# Altium schematic sheet Roomba.SchDoc
size Legal
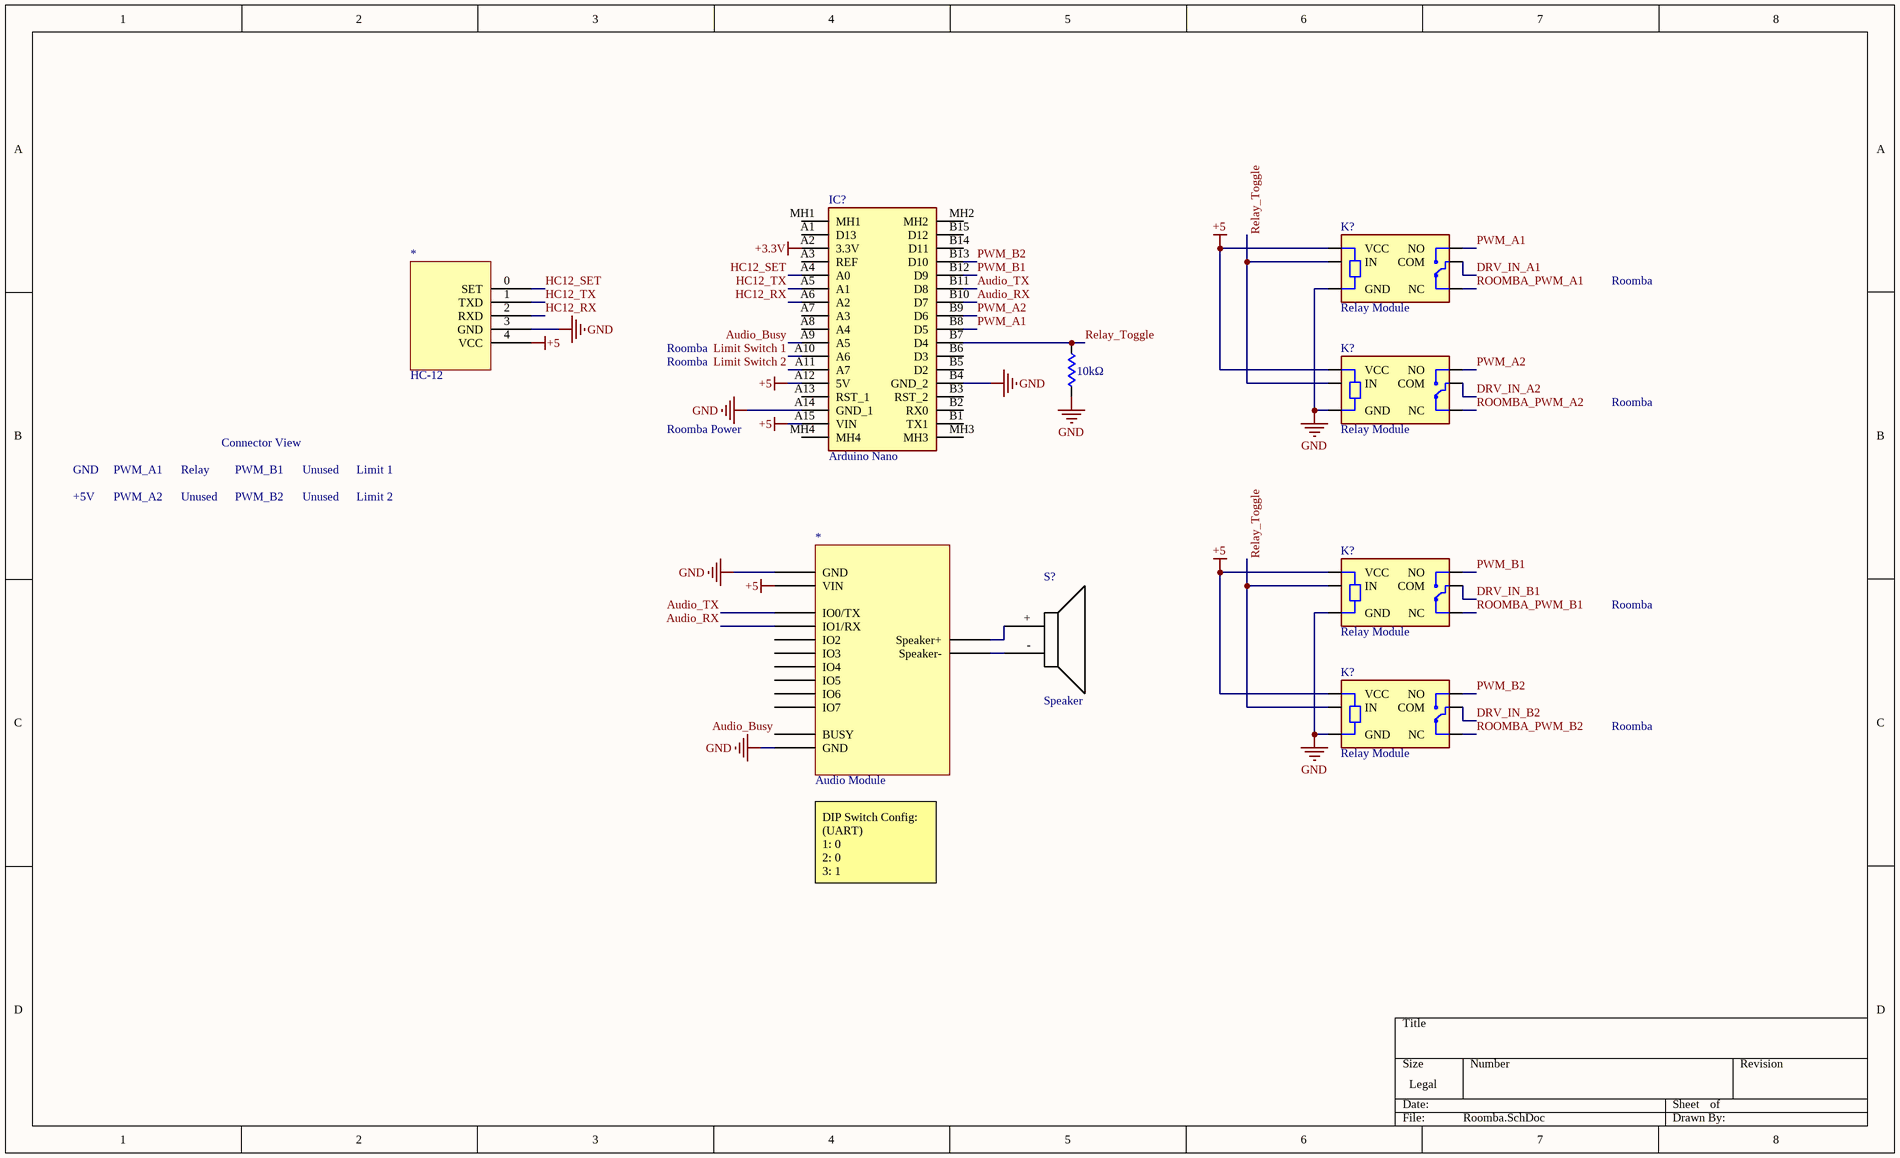
[diagram p0: Roomba.SchDoc]

## Parts
(Parts that share a designator on the sheet are numbered #1, #2 ... from top to bottom, then left to right.)
*#1  HC-12
*#2  Audio Module
?  10kΩ  [0402]
IC?  Arduino Nano  [ABX00028]
K?#1  Relay Module
K?#2  Relay Module
K?#3  Relay Module
K?#4  Relay Module
S?  Speaker

## Nets
+3.3V: IC?.A2(3.3V)
+5: *#1.4(VCC) *#2.?2(VIN) IC?.A12(5V) IC?.A15(VIN) K?#1.?1(VCC) K?#2.?1(VCC) K?#3.?1(VCC) K?#4.?1(VCC)
GND: *#1.3(GND) *#2.?1(GND) *#2.?12(GND) ?.1 IC?.A14(GND_1) IC?.B4(GND_2) K?#1.?3(GND) K?#2.?3(GND) K?#3.?3(GND) K?#4.?3(GND)
Audio_Busy: *#2.?11(BUSY) IC?.A9(A5)
Audio_RX: *#2.?4(IO1/RX) IC?.B10(D7)
Audio_TX: *#2.?3(IO0/TX) IC?.B11(D8)
DRV_IN_A1: K?#1.?5(COM)
DRV_IN_A2: K?#2.?5(COM)
DRV_IN_B1: K?#3.?5(COM)
DRV_IN_B2: K?#4.?5(COM)
HC12_RX: *#1.2(RXD) IC?.A6(A2)
HC12_SET: *#1.0(SET) IC?.A4(A0)
HC12_TX: *#1.1(TXD) IC?.A5(A1)
Limit Switch 1: IC?.A10(A6)
Limit Switch 2: IC?.A11(A7)
PWM_A1: IC?.B8(D5) K?#1.?4(NO)
PWM_A2: IC?.B9(D6) K?#2.?4(NO)
PWM_B1: IC?.B12(D9) K?#3.?4(NO)
PWM_B2: IC?.B13(D10) K?#4.?4(NO)
Relay_Toggle: ?.2 IC?.B7(D4) K?#1.?2(IN) K?#2.?2(IN) K?#3.?2(IN) K?#4.?2(IN)
ROOMBA_PWM_A1: K?#1.?6(NC)
ROOMBA_PWM_A2: K?#2.?6(NC)
ROOMBA_PWM_B1: K?#3.?6(NC)
ROOMBA_PWM_B2: K?#4.?6(NC)
Net*#2_?13: *#2.?13(Speaker+) S?.+
Net*#2_?14: *#2.?14(Speaker-) S?.-

Not connected (* = marked no-connect by the designer): *#2 ?5(IO2) ?6(IO3) ?7(IO4) ?8(IO5) ?9(IO6) ?10(IO7); IC? A1(D13) A3(REF) A7(A3) A8(A4) A13(RST_1) B1(TX1) B2(RX0) B3(RST_2) B5(D2) B6(D3) B14(D11) B15(D12) MH1 MH2 MH3 MH4

## Notes on the sheet
- Roomba
- Roomba Power
- GND
- +5V
- PWM_A1
- PWM_A2
- Relay
- Unused
- Connector View
- PWM_B1
- PWM_B2
- Limit 1
- Limit 2
- DIP Switch Config:
  (UART)
  1: 0
  2: 0
  3: 1

## Library data of the parts
? = Resistor
IC? = ABX00028: Integrated Circuit; Datasheet Link: https://store.arduino.cc/arduino-nano-every; Height: 10mm; Manufacturer_Name: Arduino; Manufacturer_Part_Number: ABX00028; Mouser Part Number: 782-ABX00028; Mouser Price/Stock: https://www.mouser.co.uk/ProductDetail/Arduino/ABX00028?qs=PzGy0jfpSMtit6rnFl8mVg%3D%3D; Arrow Part Number: ABX00028; Arrow Price/Stock: https://www.arrow.com/en/products/abx00028/arduino-corporation?region=nac
K?#1-K?#4 = Relay Module: MF: Songle Relay; MP: SRD-05VDC-SL-C; Package: None; Value: *; Availability: Not in stock; SnapEDA_Link: https://www.snapeda.com/parts/SRD-05VDC-SL-C/Songle+Relay/view-part/?ref=snap; Price: None; Check_prices: https://www.snapeda.com/parts/SRD-05VDC-SL-C/Songle+Relay/view-part/?ref=eda